# EAGLE schematic iotchair_uno-shield (EAGLE 6.5.0)
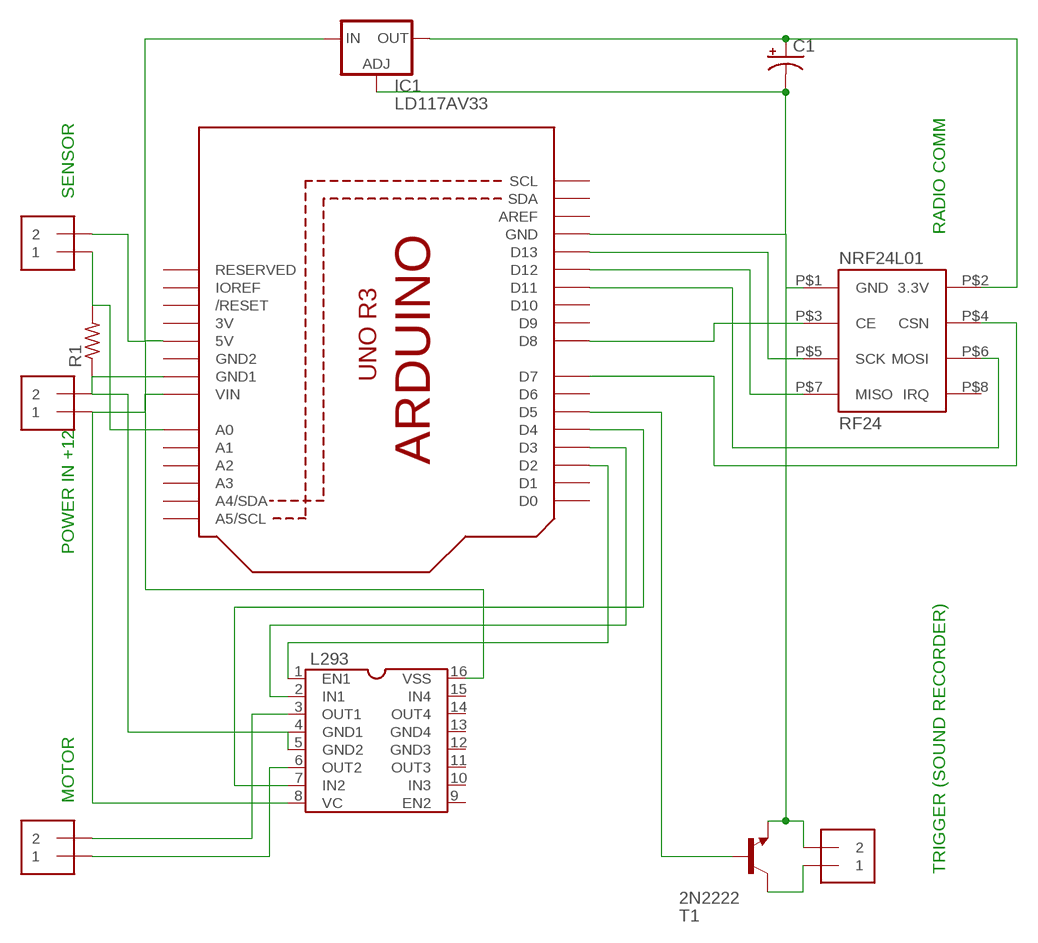
[diagram p0: schematic, sheet 1]

## Parts
+12V  1X2-3.5MM  [1X2-3.5MM]
A_SENS  1X2-3.5MM  [1X2-3.5MM]
C1  CPOL-USE2-5  [E2-5]
IC1  LD117AV33  [TO220L1]
L293  DIL16  [DIL16]
MOTOR  1X2-3.5MM  [1X2-3.5MM]
NRF24L01  RF24  [4X2HEADER]
R1  R-US_0207/10  [0207/10]
T1  2N2222  [TO92-EBC-OVAL]
TRIGGER  1X2-3.5MM  [1X2-3.5MM]
U1  ARDUINOR3-DIMENSION  [ARDUINOR3]

## Nets
N$1: A_SENS.2 IC1.3(IN) L293.16(VSS) U1.5V
N$2: C1.+ IC1.2(OUT) NRF24L01.P$2(3.3V)
N$3: C1.- IC1.1(ADJ) NRF24L01.P$1(GND) T1.E TRIGGER.2 U1.GND
N$4: NRF24L01.P$5(SCK) U1.D13
N$5: NRF24L01.P$3(CE) U1.D8
N$6: NRF24L01.P$7(MISO) U1.D12
N$7: NRF24L01.P$6(MOSI) U1.D11
N$8: NRF24L01.P$4(CSN) U1.D7
N$9: A_SENS.1 R1.2 U1.A0
N$10: L293.6(OUT2) MOTOR.1
N$11: +12V.2 L293.4(GND1) L293.5(GND2) R1.1 U1.GND1
N$12: +12V.1 L293.8(VC) U1.VIN
N$13: L293.3(OUT1) MOTOR.2
N$14: L293.1(EN1) U1.D2
N$15: L293.2(IN1) U1.D3
N$16: L293.7(IN2) U1.D4
N$17: T1.C TRIGGER.1
N$19: T1.B U1.D5
Unconnected: L293.9(EN2) L293.10(IN3) L293.11(OUT3) L293.12(GND3) L293.13(GND4) L293.14(OUT4) L293.15(IN4) NRF24L01.P$8(IRQ) U1.A1 U1.A2 U1.A3 U1.A4(A4/SDA) U1.A5(A5/SCL) U1.AREF U1.D0 U1.D1 U1.D6 U1.D9 U1.D10 U1.IOREF U1.RESERVED U1.RESET(/RESET) U1.SCL U1.SDA

## Notes on the sheet
- SENSOR
- RADIO COMM
- POWER IN +12
- MOTOR
- TRIGGER (SOUND RECORDER)

## Power pins joined to a net without a drawn wire
3V: U1.3V
GND2: U1.GND2

## Library data of the parts
+12V A_SENS MOTOR TRIGGER = adafruit:1X2: 3.5mm Terminal block http://www.ladyada.net/library/pcb/eaglelibrary.html
C1 = adafruit:CPOL-US: POLARIZED CAPACITOR, American symbol
IC1 = v-reg:LD117A?*: Low drop fixed and adjustable positive voltage regulators 1 A Source: http://www.st.com/stonline/products/literature/ds/7194/ld1117axx.pdf
L293 = l293:DIL16: Dual In Line / Socket
NRF24L01 = rf24:RF24
R1 = adafruit:R-US_: RESISTOR, American symbol
T1 = adafruit:2N2222: NPN TRANSISTOR Big oval pads
U1 = adafruit:ARDUINOR3: This is a new object for the new Arduino R3 - with extra pins that you may want to use (such as IOref, and duplicated A4/A5